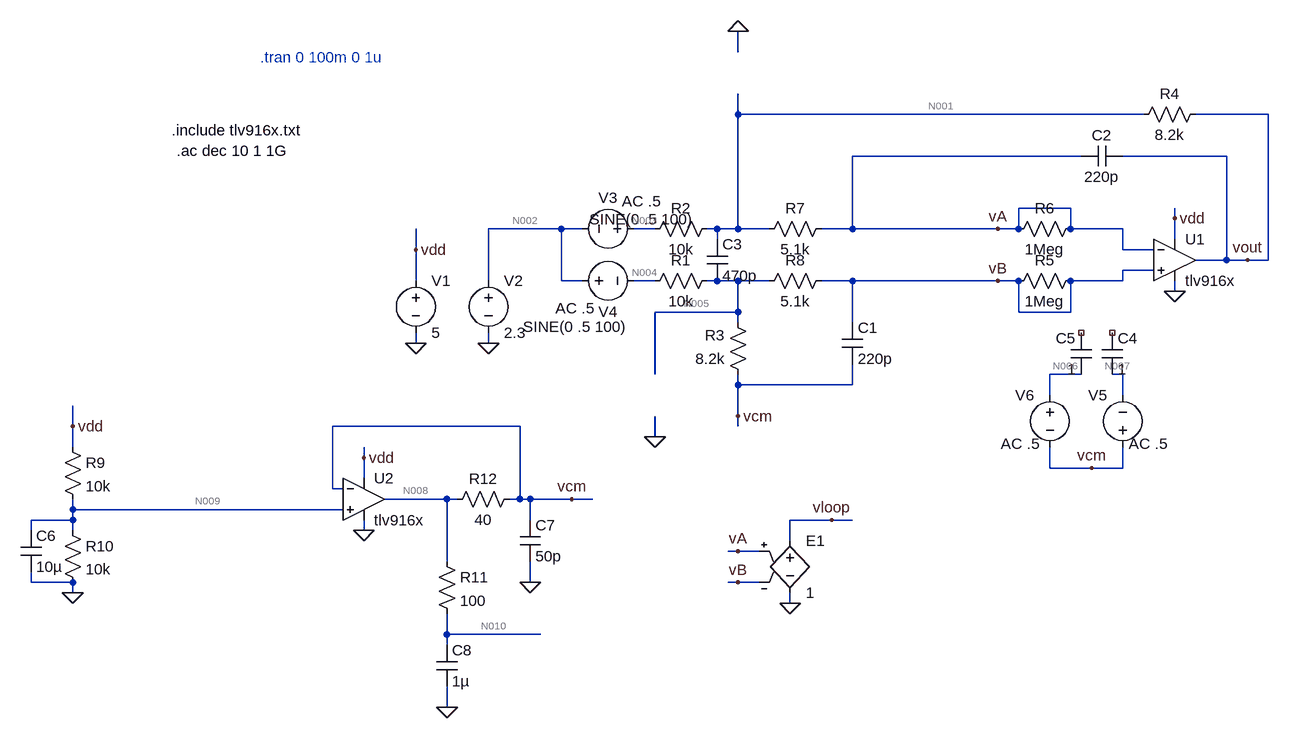
[diagram p0: schematic SigGen.asc]
SigGen.asc, the LTspice schematic file:
Version 4.1
SHEET 1 1084 884
WIRE 256 -144 256 -176
WIRE 256 -48 256 -80
WIRE 880 -48 256 -48
WIRE 1072 -48 960 -48
WIRE 784 16 432 16
WIRE 1008 16 848 16
WIRE 768 96 688 96
WIRE 928 112 928 96
WIRE -16 128 -128 128
WIRE 16 128 -16 128
WIRE 128 128 96 128
WIRE 224 128 208 128
WIRE 256 128 256 -48
WIRE 256 128 224 128
WIRE 304 128 256 128
WIRE 432 128 432 16
WIRE 432 128 384 128
WIRE 656 128 432 128
WIRE 688 128 688 96
WIRE 688 128 656 128
WIRE 768 128 768 96
WIRE 848 128 768 128
WIRE 224 144 224 128
WIRE 928 144 928 112
WIRE -240 160 -240 128
WIRE 848 160 848 128
WIRE 896 160 848 160
WIRE 1008 176 1008 16
WIRE 1008 176 960 176
WIRE 1040 176 1008 176
WIRE 1072 176 1072 -48
WIRE 1072 176 1040 176
WIRE 896 192 848 192
WIRE -240 208 -240 160
WIRE -128 208 -128 128
WIRE -16 208 -16 128
WIRE 16 208 -16 208
WIRE 128 208 96 208
WIRE 224 208 208 208
WIRE 256 208 224 208
WIRE 304 208 256 208
WIRE 432 208 384 208
WIRE 656 208 432 208
WIRE 688 208 656 208
WIRE 848 208 848 192
WIRE 848 208 768 208
WIRE 928 224 928 208
WIRE 256 256 256 208
WIRE 256 256 128 256
WIRE 688 256 688 208
WIRE 768 256 768 208
WIRE 768 256 688 256
WIRE 256 272 256 256
WIRE 432 272 432 208
WIRE -240 304 -240 288
WIRE -128 304 -128 288
WIRE 128 352 128 256
WIRE 784 352 736 352
WIRE 848 352 832 352
WIRE 256 368 256 352
WIRE 432 368 432 336
WIRE 432 368 256 368
WIRE 736 384 736 352
WIRE 848 384 848 352
WIRE 256 416 256 368
WIRE -768 432 -768 400
WIRE -80 432 -368 432
WIRE 256 432 256 416
WIRE 128 448 128 416
WIRE -768 464 -768 432
WIRE -320 480 -320 464
WIRE 736 496 736 464
WIRE 800 496 736 496
WIRE 848 496 848 464
WIRE 848 496 800 496
WIRE -320 512 -320 480
WIRE -368 528 -368 432
WIRE -352 528 -368 528
WIRE -192 544 -288 544
WIRE -176 544 -192 544
WIRE -80 544 -80 432
WIRE -80 544 -96 544
WIRE -64 544 -80 544
WIRE 0 544 -64 544
WIRE 32 544 0 544
WIRE -768 560 -768 544
WIRE -352 560 -768 560
WIRE -768 576 -768 560
WIRE -768 576 -832 576
WIRE -64 576 -64 544
WIRE 400 576 336 576
WIRE 432 576 400 576
WIRE -832 592 -832 576
WIRE -768 592 -768 576
WIRE -320 592 -320 576
WIRE 336 608 336 576
WIRE 256 624 240 624
WIRE 288 624 256 624
WIRE -192 640 -192 544
WIRE -832 672 -832 656
WIRE -768 672 -832 672
WIRE -64 672 -64 640
WIRE 256 672 240 672
WIRE 288 672 256 672
WIRE -768 688 -768 672
WIRE 336 704 336 688
WIRE -192 752 -192 720
WIRE -48 752 -192 752
WIRE -192 768 -192 752
WIRE -192 864 -192 832
FLAG 928 224 0
FLAG 928 112 vdd
FLAG -240 304 0
FLAG -240 160 vdd
FLAG 256 416 vcm
FLAG 1040 176 vout
FLAG 800 496 vcm
FLAG 656 128 vA
FLAG 656 208 vB
FLAG 336 704 0
FLAG 256 624 vA
FLAG 256 672 vB
FLAG 400 576 vloop
FLAG 128 448 0
FLAG 256 -176 0
FLAG -320 592 0
FLAG -320 480 vdd
FLAG -768 688 0
FLAG -768 432 vdd
FLAG -64 672 0
FLAG 0 544 vcm
FLAG -192 864 0
FLAG -128 304 0
SYMBOL OpAmps\\opamp2 928 112 R0
SYMATTR InstName U1
SYMATTR Value tlv916x
SYMBOL voltage -240 192 R0
WINDOW 123 0 0 Left 0
WINDOW 39 0 0 Left 0
SYMATTR InstName V1
SYMATTR Value 5
SYMBOL voltage 112 128 R90
WINDOW 0 -32 56 VBottom 2
WINDOW 3 -30 5 VTop 2
WINDOW 123 -58 5 VTop 2
WINDOW 39 0 0 Left 0
SYMATTR InstName V3
SYMATTR Value SINE(0 .5 100)
SYMATTR Value2 AC .5
SYMBOL voltage 0 208 R270
WINDOW 0 -32 56 VBottom 2
WINDOW 3 -86 5 VTop 2
WINDOW 123 -58 5 VTop 2
WINDOW 39 0 0 Left 0
SYMATTR InstName V4
SYMATTR Value SINE(0 .5 100)
SYMATTR Value2 AC .5
SYMBOL res 224 192 R90
WINDOW 0 0 56 VBottom 2
WINDOW 3 32 56 VTop 2
SYMATTR InstName R1
SYMATTR Value 10k
SYMBOL res 224 112 R90
WINDOW 0 0 56 VBottom 2
WINDOW 3 32 56 VTop 2
SYMATTR InstName R2
SYMATTR Value 10k
SYMBOL res 272 368 R180
WINDOW 0 36 76 Left 2
WINDOW 3 36 40 Left 2
SYMATTR InstName R3
SYMATTR Value 8.2k
SYMBOL res 864 -32 R270
WINDOW 0 32 56 VTop 2
WINDOW 3 0 56 VBottom 2
SYMATTR InstName R4
SYMATTR Value 8.2k
SYMBOL res 784 112 R90
WINDOW 0 0 56 VBottom 2
WINDOW 3 32 56 VTop 2
SYMATTR InstName R6
SYMATTR Value 1Meg
SYMBOL res 784 192 R90
WINDOW 0 0 56 VBottom 2
WINDOW 3 32 56 VTop 2
SYMATTR InstName R5
SYMATTR Value 1Meg
SYMBOL cap 816 288 R0
SYMATTR InstName C4
SYMATTR Value 1
SYMBOL cap 800 288 M0
SYMATTR InstName C5
SYMATTR Value 1
SYMBOL voltage 736 368 M0
WINDOW 123 16 91 Left 2
WINDOW 39 0 0 Left 0
SYMATTR Value2 AC .5
SYMATTR InstName V6
SYMATTR Value ""
SYMBOL voltage 848 480 R180
WINDOW 0 24 96 Left 2
WINDOW 3 24 16 Left 2
WINDOW 123 -69 21 Left 2
WINDOW 39 0 0 Left 0
SYMATTR InstName V5
SYMATTR Value ""
SYMATTR Value2 AC .5
SYMBOL e 336 592 R0
SYMATTR InstName E1
SYMATTR Value 1
SYMBOL cap 416 272 R0
SYMATTR InstName C1
SYMATTR Value 220p
SYMBOL cap 848 0 R90
WINDOW 0 0 32 VBottom 2
WINDOW 3 32 32 VTop 2
SYMATTR InstName C2
SYMATTR Value 220p
SYMBOL cap 208 144 R0
SYMATTR InstName C3
SYMATTR Value 470p
SYMBOL res 400 112 R90
WINDOW 0 0 56 VBottom 2
WINDOW 3 32 56 VTop 2
SYMATTR InstName R7
SYMATTR Value 5.1k
SYMBOL res 400 192 R90
WINDOW 0 0 56 VBottom 2
WINDOW 3 32 56 VTop 2
SYMATTR InstName R8
SYMATTR Value 5.1k
SYMBOL OpAmps\\opamp2 -320 480 R0
SYMATTR InstName U2
SYMATTR Value tlv916x
SYMBOL res -784 448 R0
SYMATTR InstName R9
SYMATTR Value 10k
SYMBOL res -784 576 R0
SYMATTR InstName R10
SYMATTR Value 10k
SYMBOL cap -848 592 R0
SYMATTR InstName C6
SYMATTR Value 10µ
SYMBOL res -208 624 R0
SYMATTR InstName R11
SYMATTR Value 100
SYMBOL cap -208 768 R0
SYMATTR InstName C8
SYMATTR Value 1µ
SYMBOL voltage -128 192 R0
WINDOW 123 0 0 Left 0
WINDOW 39 0 0 Left 0
SYMATTR InstName V2
SYMATTR Value 2.3
SYMBOL cap -80 576 R0
SYMATTR InstName C7
SYMATTR Value 50p
SYMBOL res -80 528 R90
WINDOW 0 0 56 VBottom 2
WINDOW 3 32 56 VTop 2
SYMATTR InstName R12
SYMATTR Value 40
TEXT -616 -24 Left 2 !.include tlv916x.txt
TEXT -608 8 Left 2 !.ac dec 10 1 1G
TEXT -480 -136 Left 2 ;.tran 0 100m 0 1u

The netlist it stands for:
* SigGen.asc
X§U1 vB vA vdd 0 vout tlv916x  ; pins In+ In- V+ V- OUT
V1 vdd 0 5
V3 N003 N002 SINE(0 .5 100) AC .5
V4 N002 N004 SINE(0 .5 100) AC .5
R1 N005 N004 10k
R2 N001 N003 10k
R3 vcm N005 8.2k
R4 N001 vout 8.2k
R6 vA vA 1Meg
R5 vB vB 1Meg
C4 NC_01 N007 1
C5 NC_02 N006 1
V6 N006 vcm AC .5
V5 vcm N007 AC .5
E1 vloop 0 vA vB 1
C1 vB vcm 220p
C2 vout vA 220p
C3 N001 N005 470p
R7 vA N001 5.1k
R8 vB N005 5.1k
X§U2 N009 vcm vdd 0 N008 tlv916x  ; pins In+ In- V+ V- OUT
R9 vdd N009 10k
R10 N009 0 10k
C6 N009 0 10µ
R11 N008 N010 100
C8 N010 0 1µ
V2 N002 0 2.3
C7 vcm 0 50p
R12 vcm N008 40
.include tlv916x.txt
.ac dec 10 1 1G
* .tran 0 100m 0 1u
.backanno
.end

* Results of the author's LTspice run, read from the files saved beside the schematic
* Operating Point, zero values left out:
*   V(n001) = 2.405 V
*   V(n002) = 2.3 V
*   V(n003) = 2.3 V
*   V(n004) = 2.3 V
*   V(n005) = 2.404 V
*   V(n006) = 2.49 V
*   V(n007) = 2.49 V
*   V(n008) = 2.49 V
*   V(n009) = 2.5 V
*   V(n010) = 2.49 V
*   V(va) = 2.405 V
*   V(vb) = 2.404 V
*   V(vcm) = 2.49 V
*   V(vdd) = 5 V
*   V(vloop) = 218.5 µV
*   V(vout) = 2.49 V
*   I(R1) = 10.44 µA
*   I(R10) = 250 µA
*   I(R12) = -10.44 µA
*   I(R2) = 10.46 µA
*   I(R3) = 10.44 µA
*   I(R4) = -10.46 µA
*   I(R8) = -9.904 pA
*   I(R9) = 250 µA
*   I(V1) = -5.071 mA
*   I(V2) = 20.9 µA
*   I(V3) = 10.46 µA
*   I(V4) = -10.44 µA
*   Ix(u1:in+) = 9.903 pA
*   Ix(u1:out) = -10.46 µA
*   Ix(u1:vcc) = 2.41 mA
*   Ix(u1:vee) = -2.4 mA
*   Ix(u2:in+) = 9.992 pA
*   Ix(u2:out) = -10.44 µA
*   Ix(u2:vcc) = 2.41 mA
*   Ix(u2:vee) = -2.4 mA
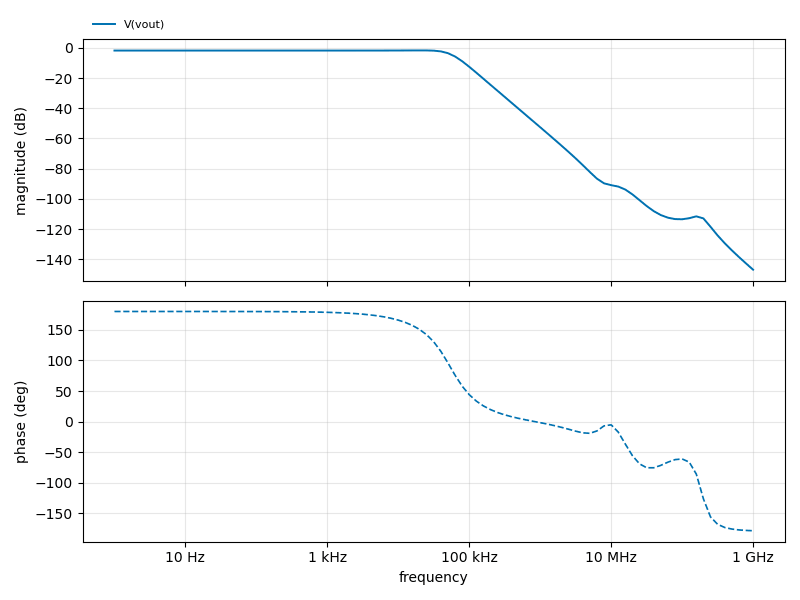
[diagram p1: AC Analysis of SigGen.asc, plotted from the saved traces]
* AC Analysis, 1 run:
*   V(vout): -1.72 dB at 1 Hz, -146.96 dB at 1 GHz, peak -1.62 dB at 19.95 kHz, 3 dB below the peak at 56.64 kHz